# EAGLE board ADAT DeEnkoder v2 (EAGLE 5.03), part 1 of 2
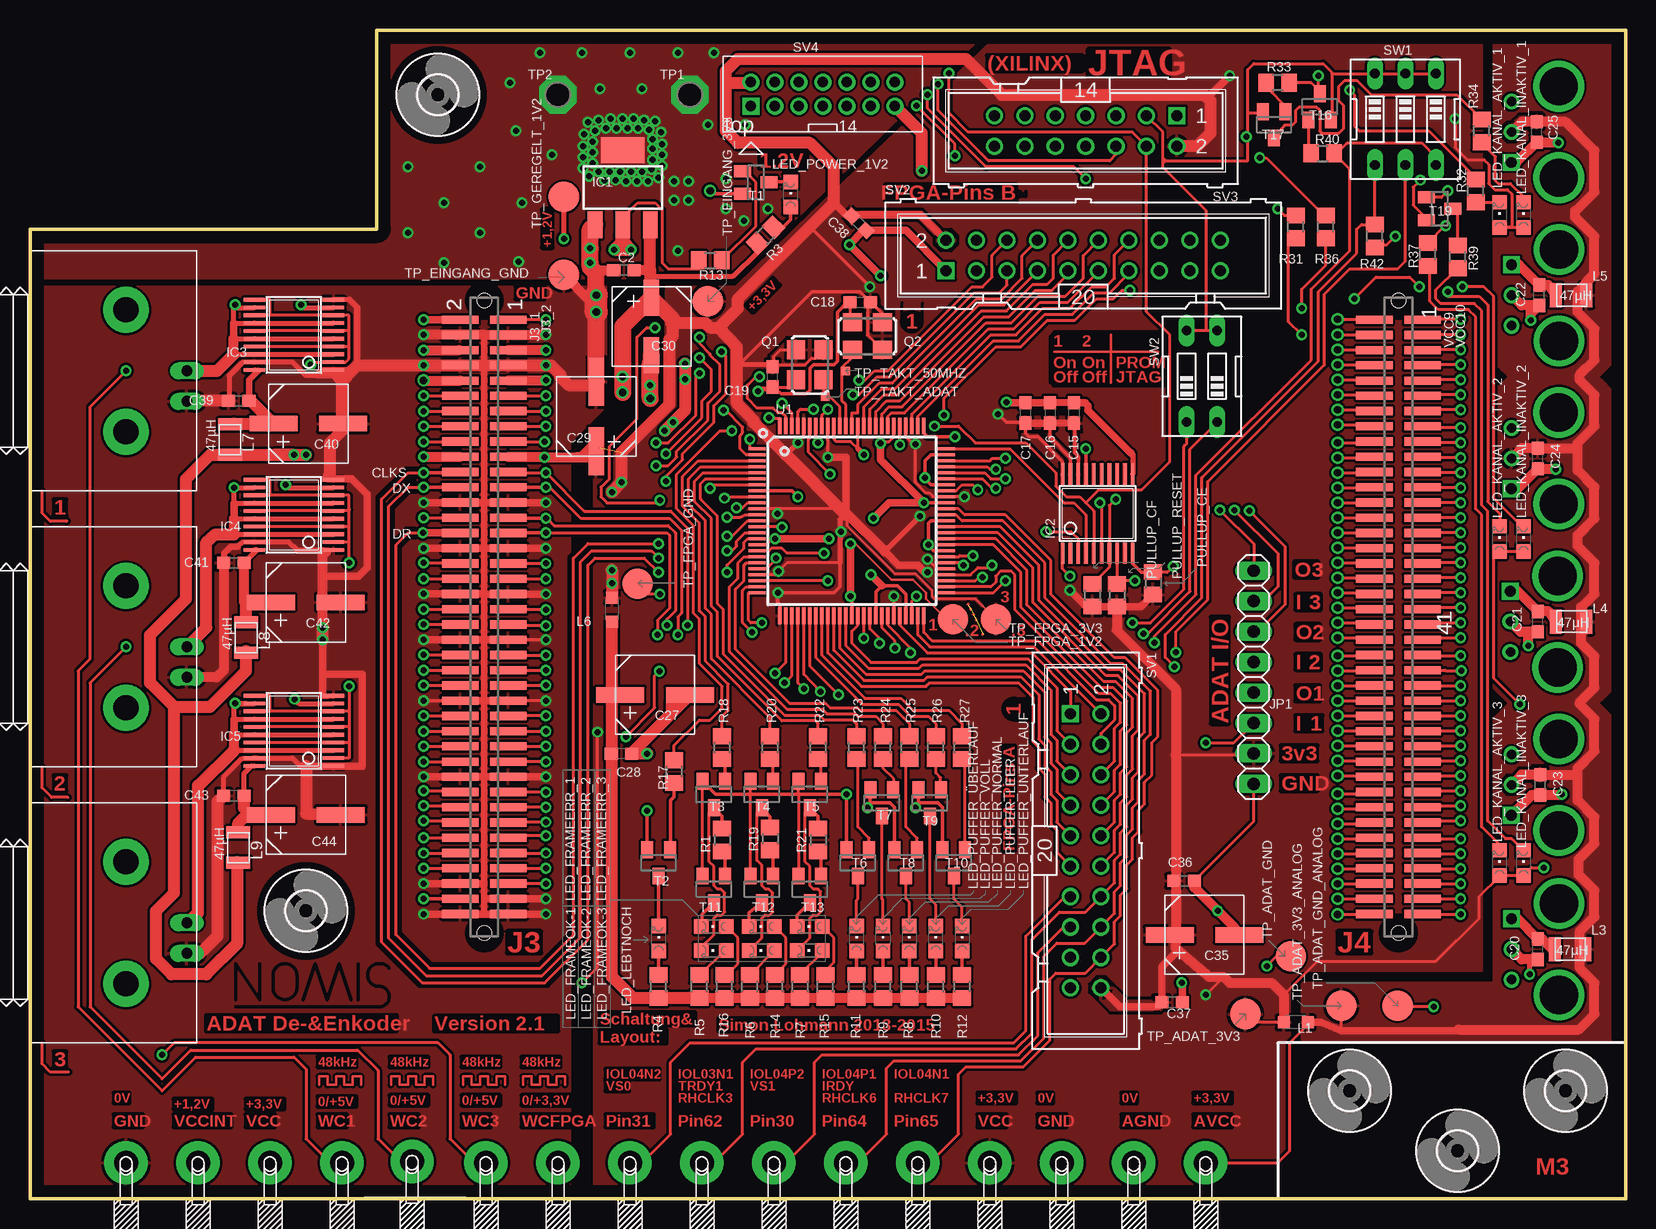
[diagram p2: board, top side]
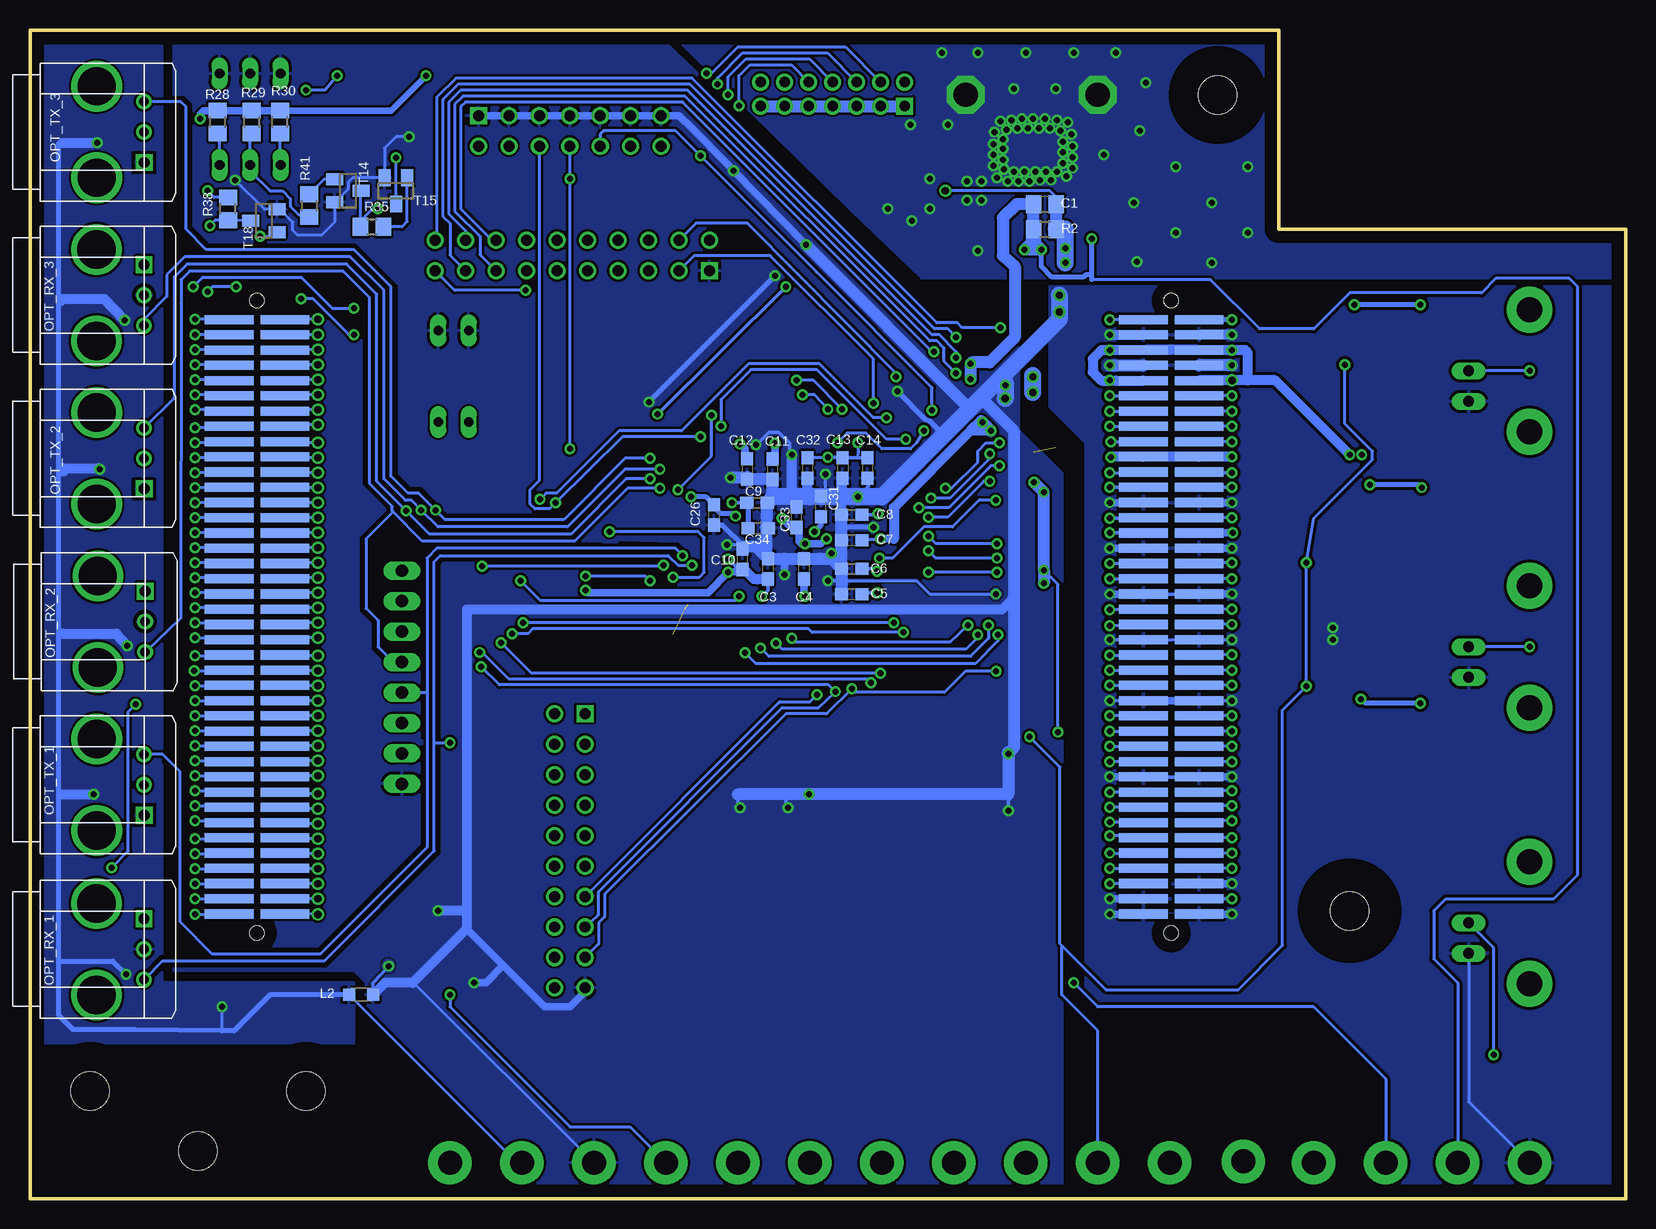
[diagram p3: board, bottom side, seen from below]

Size 133 x 97.4 mm. Coordinates in mm from the lower left corner, seen from the top.
Outline: 0,0 0,80.8 28.9,80.8 28.9,97.4 133,97.4 133,0 0,0
Copper layers (1*16): Top 0.035mm / dielectric 1.5mm / Bottom 0.035mm
Design rules "default *": minimum track width 0.2mm, minimum drill 0.4mm, track to track 0.2mm, track to pad 8mil, pad to pad 8mil, via to via 8mil, smd to smd 8mil, copper to edge 40mil, drill to drill 8mil, minimum pad ring 10mil, minimum via ring 8mil, stop-mask expansion 4mil, vias tented up to drill 0mil, thermal gap 10mil
tKeepout: area 17.2,81.8 to 27.9,95.6
tRestrict: area 81.1,39.9 to 82.9,41.7; area 72.6,72.2 to 74.4,74; 192 lines
bRestrict: area 122.5,47.2 to 124.3,49; area 122.7,74.5 to 124.3,76.1; 82 lines

## Footprints (pad centres in the part's own frame; a part is rotated, then mirrored left to right if it is on the bottom)
C0805 = smd 1.3 x 1.5: 1 -0.95,0; 2 0.95,0
C0603 = smd 1.1 x 1: 1 -0.85,0; 2 0.85,0
6.3²_LONGPADS = smd 1.3 x 4: + 0,2.9; - 0,-2.9
6.3² = smd 1.3 x 3: + 0,2.4; - 0,-2.4
SOT223 = smd 1.219 x 2.235: 1 -2.311,-3.099; 2 0,-3.099; 3 2.311,-3.099 | smd 3.6 x 2.2: 4 0,3.099
TSSOP20_LONGPAD = smd 0.305 x 1.778: 1 -2.925,-3.299; 2 -2.275,-3.299; 3 -1.625,-3.299; 4 -0.975,-3.299; 5 -0.325,-3.299; 6 0.325,-3.299; 7 0.975,-3.299; 8 1.625,-3.299; 9 2.275,-3.299; 10 2.925,-3.299; 11 2.925,3.299; 12 2.275,3.299; 13 1.625,3.299; 14 0.975,3.299; 15 0.325,3.299; 16 -0.325,3.299; 17 -0.975,3.299; 18 -1.625,3.299; 19 -2.275,3.299; 20 -2.925,3.299
J3_2X40SMD_TOP = smd 0.686 x 3.048: 1 -24.765,2.002; 2 -24.765,-2.002; 3 -23.495,2.002; 4 -23.495,-2.002; 5 -22.225,2.002; 6 -22.225,-2.002; 7 -20.955,2.002; 8 -20.955,-2.002; 9 -19.685,2.002; 10 -19.685,-2.002; 11 -18.415,2.002; 12 -18.415,-2.002; 13 -17.145,2.002; 14 -17.145,-2.002; 15 -15.875,2.002; 16 -15.875,-2.002; 17 -14.605,2.002; 18 -14.605,-2.002; 19 -13.335,2.002; 20 -13.335,-2.002; 21 -12.065,2.002; 22 -12.065,-2.002; 23 -10.795,2.002; 24 -10.795,-2.002; 25 -9.525,2.002; 26 -9.525,-2.002; 27 -8.255,2.002; 28 -8.255,-2.002; 29 -6.985,2.002; 30 -6.985,-2.002; 31 -5.715,2.002; 32 -5.715,-2.002; 33 -4.445,2.002; 34 -4.445,-2.002; 35 -3.175,2.002; 36 -3.175,-2.002; 37 -1.905,2.002; 38 -1.905,-2.002; 39 -0.635,2.002; 40 -0.635,-2.002; 41 0.635,2.002; 42 0.635,-2.002; 43 1.905,2.002; 44 1.905,-2.002; 45 3.175,2.002; 46 3.175,-2.002; 47 4.445,2.002; 48 4.445,-2.002; 49 5.715,2.002; 50 5.715,-2.002; 51 6.985,2.002; 52 6.985,-2.002; 53 8.255,2.002; 54 8.255,-2.002; 55 9.525,2.002; 56 9.525,-2.002; 57 10.795,2.002; 58 10.795,-2.002; 59 12.065,2.002; 60 12.065,-2.002; 61 13.335,2.002; 62 13.335,-2.002; 63 14.605,2.002; 64 14.605,-2.002; 65 15.875,2.002; 66 15.875,-2.002; 67 17.145,2.002; 68 17.145,-2.002; 69 18.415,2.002; 70 18.415,-2.002; 71 19.685,2.002; 72 19.685,-2.002; 73 20.955,2.002; 74 20.955,-2.002; 75 22.225,2.002; 76 22.225,-2.002; 77 23.495,2.002; 78 23.495,-2.002; 79 24.765,2.002; 80 24.765,-2.002 | hole 1.2: -26.352,0; 26.352,0
J3_2X40SMD_BOTTOM = smd 0.762 x 4.064 bottom: 1 -24.765,2.32; 2 -24.765,-2.32; 3 -23.495,2.32; 4 -23.495,-2.32; 5 -22.225,2.32; 6 -22.225,-2.32; 7 -20.955,2.32; 8 -20.955,-2.32; 9 -19.685,2.32; 10 -19.685,-2.32; 11 -18.415,2.32; 12 -18.415,-2.32; 13 -17.145,2.32; 14 -17.145,-2.32; 15 -15.875,2.32; 16 -15.875,-2.32; 17 -14.605,2.32; 18 -14.605,-2.32; 19 -13.335,2.32; 20 -13.335,-2.32; 21 -12.065,2.32; 22 -12.065,-2.32; 23 -10.795,2.32; 24 -10.795,-2.32; 25 -9.525,2.32; 26 -9.525,-2.32; 27 -8.255,2.32; 28 -8.255,-2.32; 29 -6.985,2.32; 30 -6.985,-2.32; 31 -5.715,2.32; 32 -5.715,-2.32; 33 -4.445,2.32; 34 -4.445,-2.32; 35 -3.175,2.32; 36 -3.175,-2.32; 37 -1.905,2.32; 38 -1.905,-2.32; 39 -0.635,2.32; 40 -0.635,-2.32; 41 0.635,2.32; 42 0.635,-2.32; 43 1.905,2.32; 44 1.905,-2.32; 45 3.175,2.32; 46 3.175,-2.32; 47 4.445,2.32; 48 4.445,-2.32; 49 5.715,2.32; 50 5.715,-2.32; 51 6.985,2.32; 52 6.985,-2.32; 53 8.255,2.32; 54 8.255,-2.32; 55 9.525,2.32; 56 9.525,-2.32; 57 10.795,2.32; 58 10.795,-2.32; 59 12.065,2.32; 60 12.065,-2.32; 61 13.335,2.32; 62 13.335,-2.32; 63 14.605,2.32; 64 14.605,-2.32; 65 15.875,2.32; 66 15.875,-2.32; 67 17.145,2.32; 68 17.145,-2.32; 69 18.415,2.32; 70 18.415,-2.32; 71 19.685,2.32; 72 19.685,-2.32; 73 20.955,2.32; 74 20.955,-2.32; 75 22.225,2.32; 76 22.225,-2.32; 77 23.495,2.32; 78 23.495,-2.32; 79 24.765,2.32; 80 24.765,-2.32 | hole 1.2: -26.352,0; 26.352,0
1X08 = drill 1.016 long: 1 -8.89,0; 2 -6.35,0; 3 -3.81,0; 4 -1.27,0; 5 1.27,0; 6 3.81,0; 7 6.35,0; 8 8.89,0
L2012C = smd 1 x 1: 1 -1,0; 2 1,0
1007_(2518METR.)_LONGPAD = smd 1 x 2: P$1 1.3,0; P$2 -1.24,0
CHIPLED_0805 = smd 1.2 x 1.2: A 0,-1.05; C 0,1.05
T = drill 0.9 square: 1 2.54,0 | drill 0.8 round: 2 0,0; 3 -2.54,0 | drill 3.2 pad 3.4 round: P$1 -3.81,3.95; P$2 3.81,3.95
PLT133 = drill 0.9 square: 1 -2.54,-3.81 | drill 0.8 round: 2 0,-3.81; 3 2.54,-3.81 | drill 3.2 pad 3.4 round: P$1 -3.81,0.14; P$2 3.81,0.14
R0805 = smd 1.3 x 1.5: 1 -0.95,0; 2 0.95,0
ASF = smd 1.6 x 1.5: 1 -1.25,-1.15; 2 1.25,-1.15; 3 1.25,1.15; 4 -1.25,1.15
ML20_ROUND_PAD = drill 0.914 square: 1 -11.43,-1.27 | drill 0.914 round: 2 -11.43,1.27; 3 -8.89,-1.27; 4 -8.89,1.27; 5 -6.35,-1.27; 6 -6.35,1.27; 7 -3.81,-1.27; 8 -3.81,1.27; 9 -1.27,-1.27; 10 -1.27,1.27; 11 1.27,-1.27; 12 1.27,1.27; 13 3.81,-1.27; 14 3.81,1.27; 15 6.35,-1.27; 16 6.35,1.27; 17 8.89,-1.27; 18 8.89,1.27; 19 11.43,-1.27; 20 11.43,1.27
ML14_ROUND_PAD = drill 0.914 square: 1 -7.62,-1.27 | drill 0.914 round: 2 -7.62,1.27; 3 -5.08,-1.27; 4 -5.08,1.27; 5 -2.54,-1.27; 6 -2.54,1.27; 7 0,-1.27; 8 0,1.27; 9 2.54,-1.27; 10 2.54,1.27; 11 5.08,-1.27; 12 5.08,1.27; 13 7.62,-1.27; 14 7.62,1.27
87831-1420 = drill 0.9 square: 1 -6,-1 | drill 0.9 round: 2 -6,1; 3 -4,-1; 4 -4,1; 5 -2,-1; 6 -2,1; 7 0,-1; 8 0,1; 9 2,-1; 10 2,1; 11 4,-1; 12 4,1; 13 6,-1; 14 6,1
EDG-03 = drill 0.813 long: 1 -2.54,-3.81; 2 0,-3.81; 3 2.54,-3.81; 4 2.54,3.81; 5 0,3.81; 6 -2.54,3.81
EDG-02 = drill 0.813 long: 1 -1.27,-3.81; 2 1.27,-3.81; 3 1.27,3.81; 4 -1.27,3.81
SOT23 = smd 1 x 1.4: 1 -0.95,-1.1; 2 0.95,-1.1; 3 0,1.1
P1-20 = drill 2.007 pad 3.15 octagon: TP 0,0
TESTPOINT-HOOK = drill 2 pad 3.607 round: P$1 0,0
B2,54 = smd 2.54 x 2.54: TP 0,0
TP07SQ = smd 0.7 x 0.7: TP 0,0
S-PQFP-G100 = smd 1.4 x 0.254: 1 -7.9,6; 2 -7.9,5.5; 3 -7.9,5; 4 -7.9,4.5; 5 -7.9,4; 6 -7.9,3.5; 7 -7.9,3; 8 -7.9,2.5; 9 -7.9,2; 10 -7.9,1.5; 11 -7.9,1; 12 -7.9,0.5; 13 -7.9,0; 14 -7.9,-0.5; 15 -7.9,-1; 16 -7.9,-1.5; 17 -7.9,-2; 18 -7.9,-2.5; 19 -7.9,-3; 20 -7.9,-3.5; 21 -7.9,-4; 22 -7.9,-4.5; 23 -7.9,-5; 24 -7.9,-5.5; 25 -7.9,-6; 51 7.9,-6; 52 7.9,-5.5; 53 7.9,-5; 54 7.9,-4.5; 55 7.9,-4; 56 7.9,-3.5; 57 7.9,-3; 58 7.9,-2.5; 59 7.9,-2; 60 7.9,-1.5; 61 7.9,-1; 62 7.9,-0.5; 63 7.9,0; 64 7.9,0.5; 65 7.9,1; 66 7.9,1.5; 67 7.9,2; 68 7.9,2.5; 69 7.9,3; 70 7.9,3.5; 71 7.9,4; 72 7.9,4.5; 73 7.9,5; 74 7.9,5.5; 75 7.9,6 | smd 0.254 x 1.4: 26 -6,-7.9; 27 -5.5,-7.9; 28 -5,-7.9; 29 -4.5,-7.9; 30 -4,-7.9; 31 -3.5,-7.9; 32 -3,-7.9; 33 -2.5,-7.9; 34 -2,-7.9; 35 -1.5,-7.9; 36 -1,-7.9; 37 -0.5,-7.9; 38 0,-7.9; 39 0.5,-7.9; 40 1,-7.9; 41 1.5,-7.9; 42 2,-7.9; 43 2.5,-7.9; 44 3,-7.9; 45 3.5,-7.9; 46 4,-7.9; 47 4.5,-7.9; 48 5,-7.9; 49 5.5,-7.9; 50 6,-7.9; 76 6,7.9; 77 5.5,7.9; 78 5,7.9; 79 4.5,7.9; 80 4,7.9; 81 3.5,7.9; 82 3,7.9; 83 2.5,7.9; 84 2,7.9; 85 1.5,7.9; 86 1,7.9; 87 0.5,7.9; 88 0,7.9; 89 -0.5,7.9; 90 -1,7.9; 91 -1.5,7.9; 92 -2,7.9; 93 -2.5,7.9; 94 -3,7.9; 95 -3.5,7.9; 96 -4,7.9; 97 -4.5,7.9; 98 -5,7.9; 99 -5.5,7.9; 100 -6,7.9
1-1634624-0 = drill 2.1 pad 3.81 round: MOUNT1 -5.08,0; MOUNT2 5.08,0 | drill 0.9 long: SHIELD -2.54,-5.08; SIGNAL 0,-5.08
3,2 = hole 3.2: 0,0
PINHEAD_2X40SMD = smd 0.686 x 3.048: 1 -24.765,2.002; 2 -24.765,-2.002; 3 -23.495,2.002; 4 -23.495,-2.002; 5 -22.225,2.002; 6 -22.225,-2.002; 7 -20.955,2.002; 8 -20.955,-2.002; 9 -19.685,2.002; 10 -19.685,-2.002; 11 -18.415,2.002; 12 -18.415,-2.002; 13 -17.145,2.002; 14 -17.145,-2.002; 15 -15.875,2.002; 16 -15.875,-2.002; 17 -14.605,2.002; 18 -14.605,-2.002; 19 -13.335,2.002; 20 -13.335,-2.002; 21 -12.065,2.002; 22 -12.065,-2.002; 23 -10.795,2.002; 24 -10.795,-2.002; 25 -9.525,2.002; 26 -9.525,-2.002; 27 -8.255,2.002; 28 -8.255,-2.002; 29 -6.985,2.002; 30 -6.985,-2.002; 31 -5.715,2.002; 32 -5.715,-2.002; 33 -4.445,2.002; 34 -4.445,-2.002; 35 -3.175,2.002; 36 -3.175,-2.002; 37 -1.905,2.002; 38 -1.905,-2.002; 39 -0.635,2.002; 40 -0.635,-2.002; 41 0.635,2.002; 42 0.635,-2.002; 43 1.905,2.002; 44 1.905,-2.002; 45 3.175,2.002; 46 3.175,-2.002; 47 4.445,2.002; 48 4.445,-2.002; 49 5.715,2.002; 50 5.715,-2.002; 51 6.985,2.002; 52 6.985,-2.002; 53 8.255,2.002; 54 8.255,-2.002; 55 9.525,2.002; 56 9.525,-2.002; 57 10.795,2.002; 58 10.795,-2.002; 59 12.065,2.002; 60 12.065,-2.002; 61 13.335,2.002; 62 13.335,-2.002; 63 14.605,2.002; 64 14.605,-2.002; 65 15.875,2.002; 66 15.875,-2.002; 67 17.145,2.002; 68 17.145,-2.002; 69 18.415,2.002; 70 18.415,-2.002; 71 19.685,2.002; 72 19.685,-2.002; 73 20.955,2.002; 74 20.955,-2.002; 75 22.225,2.002; 76 22.225,-2.002; 77 23.495,2.002; 78 23.495,-2.002; 79 24.765,2.002; 80 24.765,-2.002 | hole 1.2: -26.352,0; 26.352,0
PINHEAD_2X40SMDBOTTOM = smd 0.762 x 4.064 bottom: 1 -24.765,2.32; 2 -24.765,-2.32; 3 -23.495,2.32; 4 -23.495,-2.32; 5 -22.225,2.32; 6 -22.225,-2.32; 7 -20.955,2.32; 8 -20.955,-2.32; 9 -19.685,2.32; 10 -19.685,-2.32; 11 -18.415,2.32; 12 -18.415,-2.32; 13 -17.145,2.32; 14 -17.145,-2.32; 15 -15.875,2.32; 16 -15.875,-2.32; 17 -14.605,2.32; 18 -14.605,-2.32; 19 -13.335,2.32; 20 -13.335,-2.32; 21 -12.065,2.32; 22 -12.065,-2.32; 23 -10.795,2.32; 24 -10.795,-2.32; 25 -9.525,2.32; 26 -9.525,-2.32; 27 -8.255,2.32; 28 -8.255,-2.32; 29 -6.985,2.32; 30 -6.985,-2.32; 31 -5.715,2.32; 32 -5.715,-2.32; 33 -4.445,2.32; 34 -4.445,-2.32; 35 -3.175,2.32; 36 -3.175,-2.32; 37 -1.905,2.32; 38 -1.905,-2.32; 39 -0.635,2.32; 40 -0.635,-2.32; 41 0.635,2.32; 42 0.635,-2.32; 43 1.905,2.32; 44 1.905,-2.32; 45 3.175,2.32; 46 3.175,-2.32; 47 4.445,2.32; 48 4.445,-2.32; 49 5.715,2.32; 50 5.715,-2.32; 51 6.985,2.32; 52 6.985,-2.32; 53 8.255,2.32; 54 8.255,-2.32; 55 9.525,2.32; 56 9.525,-2.32; 57 10.795,2.32; 58 10.795,-2.32; 59 12.065,2.32; 60 12.065,-2.32; 61 13.335,2.32; 62 13.335,-2.32; 63 14.605,2.32; 64 14.605,-2.32; 65 15.875,2.32; 66 15.875,-2.32; 67 17.145,2.32; 68 17.145,-2.32; 69 18.415,2.32; 70 18.415,-2.32; 71 19.685,2.32; 72 19.685,-2.32; 73 20.955,2.32; 74 20.955,-2.32; 75 22.225,2.32; 76 22.225,-2.32; 77 23.495,2.32; 78 23.495,-2.32; 79 24.765,2.32; 80 24.765,-2.32 | hole 1.2: -26.352,0; 26.352,0

## Placement (x,y rotation side)
C1  10µF  [C0805]  48.4,82.9 0 bottom
C2  100nF  [C0603]  49.51,77.38 180 top
C3  100nF  [C0603]  71.5,52.5 270 bottom
C4  100nF  [C0603]  68.5,52.5 270 bottom
C5  100nF  [C0603]  64.5,50.4 0 bottom
C6  100nF  [C0603]  64.5,52.5 0 bottom
C7  100nF  [C0603]  64.5,54.9 0 bottom
C8  100nF  [C0603]  64.5,57 0 bottom
C9  100nF  [C0603]  72.4,58 0 bottom
C10  100nF  [C0603]  73.6,53.3 90 bottom
C11  100nF  [C0603]  71.1,60.8 270 bottom
C12  100nF  [C0603]  73.21,60.81 270 bottom
C13  100nF  [C0603]  65.26,60.9 270 bottom
C14  100nF  [C0603]  63.2,60.9 270 bottom
C15  100nF  [C0603]  87.04,65.5 90 top
C16  100nF  [C0603]  85.01,65.5 270 top
C17  100nF  [C0603]  82.96,65.5 270 top
C18  10nF  [C0603]  69.2,74.7 0 top
C19  10nF  [C0603]  61.9,68.5 90 top
C20  100nF  [C0603]  125.7,20.8 90 top
C21  100nF  [C0603]  125.7,48.1 90 top
C22  100nF  [C0603]  125.8,75.3 90 top
C23  100nF  [C0603]  125.9,34.5 90 top
C24  100nF  [C0603]  125.7,61.7 90 top
C25  100nF  [C0603]  125.6,88.9 90 top
C26  100nF  [C0603]  76,57 270 bottom
C27  330µF  [6.3²_LONGPADS]  52.1,42 90 top
C28  100nF  [C0603]  49.3,37.1 180 top
C29  330µF  [6.3²_LONGPADS]  47.2,65.2 180 top
C30  100µF  [6.3²]  51.8,72.7 0 top
C31  10nF  [C0603]  67.05,57.7 90 bottom
C32  10nF  [C0603]  68.2,60.9 270 bottom
C33  10nF  [C0603]  69.1,56.8 90 bottom
C34  10nF  [C0603]  72.3,55.9 0 bottom
C35  100µF  [6.3²_LONGPADS]  97.9,22 90 top
C36  100nF  [C0603]  96.2,26.5 0 top
C37  100nF  [C0603]  95.2,16.4 0 top
C38  100nF  [C0603]  69.1,81.3 315 top
C39  100nF  [C0603]  17.4,66.5 0 top
C40  100µF  [6.3²_LONGPADS]  23.2,64.6 90 top
C41  100nF  [C0603]  17,53 0 top
C42  100µF  [6.3²_LONGPADS]  23,49.7 90 top
C43  100nF  [C0603]  17,33.6 0 top
C44  100µF  [6.3²_LONGPADS]  23,32 90 top
IC1  [SOT223]  49.41,84.28 0 top
IC2  XCF02S-VO20/VOG20_LONGPAD  [TSSOP20_LONGPAD]  89,57.1 0 top
IC3  74ACT244MTC/TSSOP_LONGPAD  [TSSOP20_LONGPAD]  22,72 90 top
IC4  74ACT244MTC/TSSOP_LONGPAD  [TSSOP20_LONGPAD]  22,57 90 top
IC5  74ACT244MTC/TSSOP_LONGPAD  [TSSOP20_LONGPAD]  22,39 90 top
J3_1  J3_2X40SMD127_TOP  [J3_2X40SMD_TOP]  37.87,48.5 270 top
J3_2  J3_2X40SMD127_BOTTOM  [J3_2X40SMD_BOTTOM]  37.87,48.5 270 top
JP1  ADAT I/O  [1X08]  102,43.46 270 top
L1  Ferrit R_dc<=0.1 Ohm  [L2012C]  105.5,14.7 180 top
L2  Ferrit R_dc<=0.1 Ohm  [L2012C]  105.4,17 180 bottom
L3  47µH  [1007_(2518METR.)_LONGPAD]  128.4,20.8 180 top
L4  47µH  [1007_(2518METR.)_LONGPAD]  128.5,48.1 180 top
L5  47µH  [1007_(2518METR.)_LONGPAD]  128.5,75.3 180 top
L6  Ferrit R_dc<=0.1 Ohm  [L2012C]  48.5,49.1 90 top
L7  47µH  [1007_(2518METR.)_LONGPAD]  16.67,63.24 90 top
L8  47µH  [1007_(2518METR.)_LONGPAD]  18.02,46.74 90 top
L9  47µH  [1007_(2518METR.)_LONGPAD]  17.37,29.24 90 top
LED_FRAMEERR_1  Rot  [CHIPLED_0805]  57,22.7 90 top
LED_FRAMEERR_2  Rot  [CHIPLED_0805]  61,22.7 90 top
LED_FRAMEERR_3  Rot  [CHIPLED_0805]  65,22.7 90 top
LED_FRAMEOK-1  Grün  [CHIPLED_0805]  57,20.7 90 top
LED_FRAMEOK-2  Grün  [CHIPLED_0805]  61,20.7 90 top
LED_FRAMEOK-3  Grün  [CHIPLED_0805]  65,20.7 90 top
LED_KANAL_AKTIV_1  Grün  [CHIPLED_0805]  122.5,82 0 top
LED_KANAL_AKTIV_2  Grün  [CHIPLED_0805]  122.5,55 0 top
LED_KANAL_AKTIV_3  Grün  [CHIPLED_0805]  122.5,28 0 top
LED_KANAL_INAKTIV_1  Rot  [CHIPLED_0805]  124.5,82 0 top
LED_KANAL_INAKTIV_2  Rot  [CHIPLED_0805]  124.5,55 0 top
LED_KANAL_INAKTIV_3  Rot  [CHIPLED_0805]  124.5,28 0 top
LED_LEBTNOCH  Grün  [CHIPLED_0805]  52.4,21.7 0 top
LED_POWER_1V2  Grün  [CHIPLED_0805]  63.4,83.7 0 top
LED_PUFFER_LEER  Gelb  [CHIPLED_0805]  75.5,21.7 0 top
LED_PUFFER_NORMAL  Grün  [CHIPLED_0805]  73.3,21.7 0 top
LED_PUFFER_UNTERLAUF  Rot  [CHIPLED_0805]  77.7,21.7 0 top
LED_PUFFER_VOLL  Gelb  [CHIPLED_0805]  71.1,21.7 0 top
LED_PUFFER_ÜBERLAUF  Rot  [CHIPLED_0805]  68.9,21.7 0 top
OPT_RX_1  PLR135/T  [T]  123.5,20.8 90 bottom
OPT_RX_2  PLR135/T  [T]  123.4,48.1 90 bottom
OPT_RX_3  PLR135/T  [T]  123.5,75.3 90 bottom
OPT_TX_1  PLT133  [PLT133]  127.3,34.5 90 bottom
OPT_TX_2  PLT133  [PLT133]  127.3,61.7 90 bottom
OPT_TX_3  PLT133  [PLT133]  127.3,88.9 90 bottom
PULLUP_CE  330R  [R0805]  93.62,51.3 270 top
PULLUP_CF  4k7  [R0805]  88.58,50.3 90 top
PULLUP_RESET  4k7  [R0805]  90.6,50.3 270 top
Q1  ASFL1 12.288MHz  [ASF]  65,69.5 270 top
Q2  ASFL1 50MHz  [ASF]  69.8,71.9 180 top
R1  13K  [R0805]  57.7,29.9 270 top
R2  120R  [R0805]  48.4,80.8 0 bottom
R3  55R  [R0805]  61.3,80.3 45 top
R4  55R  [R0805]  52.4,17.7 90 top
R5  55R  [R0805]  55.8,17.7 90 top
R6  55R  [R0805]  60,17.7 90 top
R7  55R  [R0805]  64.2,17.7 90 top
R8  55R  [R0805]  73.3,17.7 90 top
R9  65R  [R0805]  71.1,17.7 90 top
R10  65R  [R0805]  75.5,17.7 90 top
R11  75R  [R0805]  68.9,17.7 90 top
R12  75R  [R0805]  77.7,17.7 90 top
R13  2k5  [R0805]  56.7,78.2 0 top
R14  75R  [R0805]  62.1,17.7 90 top
R15  75R  [R0805]  66.3,17.7 90 top
R16  75R  [R0805]  57.9,17.7 90 top
R17  13K  [R0805]  53.7,35.6 90 top
R18  13K  [R0805]  57.7,37.6 90 top
R19  13K  [R0805]  61.7,30 270 top
R20  13K  [R0805]  61.7,37.6 90 top
R21  13K  [R0805]  65.7,29.9 270 top
R22  13K  [R0805]  65.7,37.6 90 top
R23  13K  [R0805]  68.9,37.6 90 top
R24  13K  [R0805]  71.1,37.6 90 top
R25  13K  [R0805]  73.3,37.6 90 top
R26  13K  [R0805]  75.5,37.6 90 top
R27  13K  [R0805]  77.7,37.6 90 top
R28  1K  [R0805]  117.36,89.74 90 bottom
R29  1K  [R0805]  114.51,89.74 90 bottom
R30  1K  [R0805]  112.16,89.74 90 bottom
R31  55R  [R0805]  105.5,81 90 top
R32  55R  [R0805]  120.5,84 90 top
R33  13K  [R0805]  104,93 180 top
R34  75R  [R0805]  121,89 90 top
R35  13K  [R0805]  104.5,81 0 bottom
R36  75R  [R0805]  108,81 90 top
R37  55R  [R0805]  116.5,78.7 90 top
R38  13K  [R0805]  116.5,82.5 90 bottom
R39  75R  [R0805]  119,78.5 90 top
R40  12K  [R0805]  107.75,87.11 0 top
R41  12K  [R0805]  109.74,82.76 270 bottom
R42  12K  [R0805]  112.09,80.24 90 top
SV1  [ML20_ROUND_PAD]  88,29 270 top
SV2  [ML20_ROUND_PAD]  87.8,78.6 0 top
SV3  [ML14_ROUND_PAD]  88,89 180 top
SV4  [87831-1420]  66.09,92.06 0 top
SW1  [EDG-03]  114.65,89.96 180 top
SW2  [EDG-02]  97.69,68.54 0 top
T1  BC847A  [SOT23]  60.5,84.7 270 top
T2  BC847A  [SOT23]  52.4,28 180 top
T3  BC847A  [SOT23]  57,33.7 180 top
T4  BC847A  [SOT23]  61,33.7 180 top
T5  BC847A  [SOT23]  65,33.7 180 top
T6  BC847A  [SOT23]  69,28 180 top
T7  BC847A  [SOT23]  71,33 180 top
T8  BC847A  [SOT23]  73,28 180 top
T9  BC847A  [SOT23]  75,33 180 top
T10  BC847A  [SOT23]  77,28 180 top
T11  BC847A  [SOT23]  57,25.8 180 top
T12  BC847A  [SOT23]  61,25.8 180 top
T13  BC847A  [SOT23]  65,25.8 180 top
T14  BC847A  [SOT23]  106.5,84 270 bottom
T15  BC847A  [SOT23]  102.5,84 180 bottom
T16  BC847A  [SOT23]  107.5,91 0 top
T17  BC847A  [SOT23]  103.7,89.5 180 top
T18  BC847A  [SOT23]  113.5,81.5 90 bottom
T19  BC847A  [SOT23]  117.5,82.5 270 top
TP1  [P1-20]  55,92 0 top
TP2  [P1-20]  44,92 0 top
TP_1  TESTPOINTHOOK  [TESTPOINT-HOOK]  80,3 0 top
TP_2  TESTPOINTHOOK  [TESTPOINT-HOOK]  98,3 0 top
TP_3  TESTPOINTHOOK  [TESTPOINT-HOOK]  92,3 0 top
TP_3V3  TESTPOINTHOOK  [TESTPOINT-HOOK]  20,3 0 top
TP_4  TESTPOINTHOOK  [TESTPOINT-HOOK]  86,3 0 top
TP_ADAT_3V3  [B2,54]  101.3,15.4 0 top
TP_ADAT_3V3_ANALOG  [B2,54]  109.3,16.1 0 top
TP_ADAT_GND  [B2,54]  105.1,20.2 0 top
TP_ADAT_GND_ANALOG  [B2,54]  114,16.1 0 top
TP_EINGANG_3V3  [B2,54]  56.5,74.8 0 top
TP_EINGANG_GND  [B2,54]  44.5,77 0 top
TP_FPGA_1V2  [B2,54]  76.92,48.29 0 top
TP_FPGA_3V3  [B2,54]  80.53,48.29 0 top
TP_FPGA_GND  [B2,54]  50.66,51.26 0 top
TP_GEREGELT_1V2  [B2,54]  44.5,83.5 0 top
TP_GND  TESTPOINTHOOK  [TESTPOINT-HOOK]  8,3 0 top
TP_GND1  TESTPOINTHOOK  [TESTPOINT-HOOK]  26,3 0 top
TP_GND4  TESTPOINTHOOK  [TESTPOINT-HOOK]  44,3 0 top
TP_GND5  TESTPOINTHOOK  [TESTPOINT-HOOK]  31.85,3.11 0 top
TP_GND6  TESTPOINTHOOK  [TESTPOINT-HOOK]  38,3 0 top
TP_IO_L03N_1/TRDY1/RHCLK3  TESTPOINTHOOK  [TESTPOINT-HOOK]  56,3 0 top
TP_IO_L04N_1/RHCLK7  TESTPOINTHOOK  [TESTPOINT-HOOK]  74,3 0 top
TP_IO_L04N_2/VS0  TESTPOINTHOOK  [TESTPOINT-HOOK]  50,3 0 top
TP_IO_L04P_1/IRDY/RHCLK6  TESTPOINTHOOK  [TESTPOINT-HOOK]  68,3 0 top
TP_IO_L04P_2/VS1  TESTPOINTHOOK  [TESTPOINT-HOOK]  62,3 0 top
TP_TAKT_50MHZ  [TP07SQ]  68,69 0 top
TP_TAKT_ADAT  [TP07SQ]  66.3,66.85 0 top
TP_VCCINT  TESTPOINTHOOK  [TESTPOINT-HOOK]  14,3 0 top
U1  XC3S200A  [S-PQFP-G100]  68.5,56.5 0 top
U$1  B6252H7NPP3G75T_  [1-1634624-0]  8,69 90 top
U$2  B6252H7NPP3G75T_  [1-1634624-0]  8,46 90 top
U$3  B6252H7NPP3G75T_  [1-1634624-0]  8,23 90 top
U$4  [3,2]  128,9 0 top
U$5  [3,2]  119,4 0 top
U$6  [3,2]  110,9 0 top
U$7  [3,2]  23,24 0 top
U$8  [3,2]  34,92 0 top
VCC9  PINHEAD_2X40SMD127  [PINHEAD_2X40SMD]  114.07,48.5 270 top
VCC10  PINHEAD_2X40SMD127BOTTOM  [PINHEAD_2X40SMDBOTTOM]  114.07,48.5 270 top

## Tracks (layer width: path | path; a pad name or v marks a point on that pad's centre or on a via)
3.3V_LED
  Top 0.254: 48.5,41.5 C27.+ | 48.6,42.2 48.5,42.4 48.6,37.6
  Top 0.305: R12.1 77.45,17
  Top 0.406: 48.5,42.2 C27.+ | 48.5,38 C28.2
  Top 0.813: R5.1 R16.1 R6.1 R14.1 R7.1 R15.1 R11.1 R9.1 R8.1 R10.1 R12.1
  Top 1.016: 48.5,42.2 L6.1 | 48.5,42.2 48.5,41.5 48.5,38 48.5,18.5 50.25,16.75 R4.1 | 48.5,42.2 48.5,42.4 | R4.1 52.4,16.8 | R4.1 R5.1 | R4.1 52.4,16.7
+3V3  (via drill 0.5, 0.6)  (1 unrouted)
  Top 0.203: 68.1,56.9 68.1,56.1 72.1,52.1 73.8,52.1 75.2,50.7 75.2,50.2 75.4,50 78.82,50 TP_FPGA_3V3.TP
  Top 0.254: U1.79 73,63.5 73.6,62.9 v73.8,62.9 73.8,59.7 74.7,58.8 75,58.8 75.3,58.5 v77.9,58.5 | U1.22 62.1,52 63.1,53 67.5,53 | 61.9,57.5 U1.11 | 61.9,57.5 v62.3,57.1 | v66.5,61.8 U1.92 | U1.96 64.5,63.6 64,63.1 v64,63 | 68,57.5 61.9,57.5 | Q2.4 69.8,72 69.8,74.4 | C18.2 69.9,74.7 69.8,74.6 69.8,74.4 | 70.1,74.7 69.8,74.4 | Q1.1 62.55,70.75 62,70.2 62,69.5 | Q1.4 66.2,70.5 65.45,70.05 65.15,70.05 64.6,69.5 62.15,69.5 | C19.2 62.15,69.5 | 62.15,69.5 62,69.5 | C19.2 62,69 | C19.2 62,69.5 | U1.55 75.6,52.5 v74.8,53.3 | C35.+ 95.7,22 95.55,22.55 | JP1.7 101.89,37 95.5,37 | TP_ADAT_3V3.TP 102,14.7 L1.2 | LED_KANAL_INAKTIV_1.A LED_KANAL_AKTIV_1.A 123.5,80.95 123.5,83.75 123.15,84.1 122.1,84.1 121.6,84.6 121.6,86.2 121.2,86.6 119.8,86.6 118.8,87.6 v118.8,90 | LED_KANAL_INAKTIV_2.A LED_KANAL_AKTIV_2.A 122.5,53.9 122,53.4 122,43.4 v124.2,41.2 | 104.5,17 107.3,19.8 117.2,19.8 120.8,23.4 120.8,25.2 122.5,26.9 LED_KANAL_AKTIV_3.A LED_KANAL_INAKTIV_3.A 125.15,27.6 v126.2,27.6 | v46,18 47.3,19.3 v47.3,38.9 | 99.5,18.5 v98,17 | J3_1.20 36,61.97 36,62 35.83,61.83 J3_2.20
  Top 0.305: v72,50.2 U1.45 | 63,62 68,57.5 | 67.5,53 67.5,51 67,50.5 62.3,50.5 62.3,49.75 62.5,49.55 U1.26 | Q2.1 71.05,73.75 70.1,74.7 69.2,75.6 65.2,75.6 59.15,69.55 60.5,69.5 | 85.1,64.4 85.01,64.51 C16.2 85.01,63.49 86.72,61.77 IC2.19 86.72,60.23 | IC1.3 51.72,81.28 | 87,65 87,64.69 C15.1 | C17.2 82.96,64.74 | C17.2 82.9,64.7 81.4,64.7 v80.7,65.4 | 64.5,80 65,81 v70,76 | IC2.18 87.38,61.88 87.1,62.15 87.1,64.59 C15.1 | 87,64.66 C15.1 | IC2.20 86.08,61.42 84,63.5 83.25,63.5 82.96,63.79 C17.2
  Top 0.406: 67.5,53 67.5,55.5 v67.6,55.6 67.5,55.6 67.5,56.6 67.9,57 68,57 | 63,62 v64,63 | 71.25,53.95 v74.2,56.9 | C19.2 62.1,69.45 62.1,69.6 62.05,69.55 59.15,69.55 58.9,69.55 | R3.1 60.65,78.9 58.6,76.9 51.8,76.9 51.7,77
  Top 0.61: v66.5,61.8 68,61.8 68,57.5 68,57 68.1,56.9 | v74.8,52.2 74.7,52.1 74,52.8 72.4,52.8 71.25,53.95 | C17.2 C16.2 87,64.66 | 95.5,22.5 95.5,20.9 95.5,20.5 94.35,19.35 C37.1 94.35,16.35 94,16 90.84,16 SV1.20 | SV2.2 74.24,82 68.6,82 C38.1 68.1,81.9 67,83 | 98.15,91.75 v100,93.6 | 45.8,61.8 47.5,63.5 47.5,62.6 C29.+ | v86.7,50.7 88.05,49.35 PULLUP_CF.1 PULLUP_RESET.2 92.62,49.35 PULLUP_CE.2
  Top 0.813: 95.5,26.5 95.5,37 95.5,42.5 90.6,47.4 PULLUP_RESET.2 | 95.5,26.5 95.5,22.5 95.55,22.55 95.55,21.55 95.5,20.9 98.3,18.5 99.5,18.5 100,18 103.5,18 104.5,17 L1.2 | 51.7,81.16 IC1.3 | 51.7,77.38 C2.1 | 95.5,26.5 C36.1 | 71.25,53.95 68.02,57.18 67.83,57.18 67.83,57.17 | 32.75,61.83 v32.8,61.83 J3_2.20 35.83,61.83 | J3_1.19 39.9,61.8 v42.9,61.8 45.6,61.8 | 45.6,61.8 46.7,61.8 C29.+ | 45.6,61.8 45.8,61.8
  Top 1.016: 57.4,72.6 56.7,72.6 56.3,73 53.6,73 53.6,71.9 53.3,71.6 53.3,66.2 49.3,62.2 v49.3,59.7 v48.5,58.9 | 57.4,72.6 58.9,71 58.9,69.55 58.9,66.3 60.3,64.9 60.3,64.7 63,62 67.83,57.17 68,57 | 51.7,77.38 51.7,81.16 | 51.7,77.38 51.7,77 | C30.+ 51.7,77.38 | 58,93 58,89 59,88 65,88 67,86 67,83 65,81 59,75 59,74.2 57.4,72.6 | 58,93 58,94 59,95 78,95 81,92 97.9,92 98.15,91.75 98.4,91.5 98.4,88.8 97.32,87.72 SV3.2 | v48.5,52.4 L6.2 | SV4.2 60.03,93 58,93 | C38.1
  Top 1.27: C30.+ 53.6,73.3 53.6,73
  Top 1.422: C30.+ 49.4,72.7 v49.4,67.2
  Bottom 0.254: v64,63 64,62 | 73.55,52.25 C10.1 | 66.6,61.75 C32.1 | 66.6,61.75 66.6,61.8 | v74.8,52.2 74.4,52.4 74,52.8 | 66.6,61.75 66.55,61.8 v66.5,61.8 | v124.2,41.2 124.8,40.6 124.8,29 v126.2,27.6 | TP_3V3.P$1 20,10 26,16 44,16 v46,18 | v47.3,38.9 47.3,51.2 v48.5,52.4 | TP_1.P$1 83,6 88,6 98,16 v98,17
  Bottom 0.305: v62.4,52.3 62.6,52.5 C6.2 | v62.3,57.1 62.4,57 C8.2 | 71.6,51.7 C3.2 71.5,50.7 v72,50.2 | v74.8,53.3 74,52.5 73.5,52.5 | v66.5,61.8 65.3,61.8 C13.1 C14.1 | v62.35,50.5 63.55,50.5 arc-90 C5.2 | v70,76 v80.7,65.4
  Bottom 0.406: 73.35,52.35 73.4,52.4 73.5,52.5 | v74.2,56.9 74.4,57.1 75.4,57.1 76,57.7 C26.1 76.65,58.5 v77.9,58.5 | C31.1 67.05,56.15 v67.6,55.6 | v66.5,61.8 66.55,61.75 | 32.83,61.83 v32.8,61.83 J3_2.20
  Bottom 0.55: R30.2 102.91,90.69 v100,93.6
  Bottom 0.61: v73.8,62.9 73.4,62.5 73.4,62 C12.1 | C3.2 72.35,51.5 73.4,52.4 73.55,52.25 v74.8,52.2 76.5,50.5 86.5,50.5 v86.7,50.7 | R30.2 R29.2 R28.2 118.51,90.69 118.8,90.4 v118.8,90
  Bottom 0.813: C3.2 72.65,51.65 73.35,52.35 | 32.83,61.83 J3_2.20 J3_2.19 42.87,61.83 v42.9,61.8
  Bottom 1.016: v49.3,59.7 v48.5,58.9 v48.5,52.4 v48.5,51.3 | 49.4,68.6 49.5,68.5 v49.4,68.5
  Bottom 1.422: v49.4,67.2 v49.4,68.5 49.4,68.6
  pour Top: 80.2,96.5 65.2,82.2 58.8,76 53,76 52.9,66.4 47,60.5 47,1 105,1 105,18 106,19 121,19 121,96.8
+5V  (via drill 0.5, 0.6)
  Top 0.254: 39.75,70.75 J3_1.5 J3_2.5 | 35.79,70.72 J3_1.6
  Top 0.305: 39.89,70.72 arc-90 J3_1.5
  Top 0.406: v43,68.2 43,68.18 | L7.P$2 17.5,62
  Top 0.813: v32.8,70.72 35.79,70.72 | v43,70.72 J3_2.5 39.89,70.72 | J3_1.10 32.82,68.18 v32.8,68.2 | J3_1.9 42.98,68.18 v43,68.2
  Top 1.016: 12,41 15,41 18,44 18,45.67 L8.P$2 | 12,41 12,25.5 10.5,24 10.5,20 11.8,18.7 14.7,18.7 17.25,21.25 17.25,28.07 L9.P$2 | v22,62 17.5,62 15,62 13,60 13,50 10,47 10,43 12,41 | v22,62 v23,62 | v22,62 20.3,62
  Bottom 0.254: 35.65,70.75 J3_2.6 | 40,70.75 J3_2.5 | 35.45,70.72 35.5,70.6 | 37.95,70.75 37.9,70.7
  Bottom 0.305: 40,70.75 40,70.72
  Bottom 0.406: 35.45,70.72 35.65,70.75
  Bottom 0.61: v43,68.2 43.2,68.2 | 40,70.75 40.03,70.72 v43,70.72
  Bottom 0.813: 40,70.75 37.95,70.75 35.65,70.75 | 35.45,70.72 v32.8,70.72 31.72,70.72 31.5,70.5 31.5,68.2 | 40,70.72 v43,70.72 43.68,70.72 44.4,70 44.4,68.9 43.68,68.18 43.02,68.18 v43,68.2 42.48,68.18 J3_2.9 | J3_2.10 35.53,68.2 v32.8,68.2 31.5,68.2 | v23,62 29.2,68.2 31.5,68.2
+12V  (via drill 0.5)
  Top 0.254: v43,73.26 J3_1.1
  Bottom 0.254: J3_2.1 v43,73.26
-12V  (via drill 0.5)
  Top 0.61: 32.75,73.26 v32.8,73.26 J3_1.2
  Bottom 0.254: v32.8,73.26 J3_2.2 35.95,73.26
  Bottom 0.406: v32.8,73.26 J3_2.2
ACE3#  (via drill 0.5)
  Top 0.254: v43,30.25 40,30.25 J3_1.69
  Bottom 0.254: v43,30.25 40.25,30.25 J3_2.69
ADAT_IN_1  (via drill 0.5)
  Top 0.254: U1.56 77.6,53 v77.8,52.8 | JP1.6 100.35,38 v98,38
  Bottom 0.254: v77.8,52.8 79,52.8 79.8,53.6 98.8,53.6 99.3,53.1 99.3,38 | 99.3,38 99.3,29 108.5,19.8 121.96,19.8 OPT_RX_1.3 | 99.3,38 v98,38
ADAT_IN_2  (via drill 0.5)
  Top 0.254: U1.70 79.4,60 80.2,59.2 v80.5,59.2
  Bottom 0.254: v80.5,59.2 83.2,59.2 87.6,54.8 100.3,54.8 102.75,57.25 | 102.75,57.25 102.8,57.3 102.8,57.7 104.7,59.6 104.7,75.1 106.9,77.3 119.7,77.3 120.4,76.6 120.4,74.6 120.44,48.4 OPT_RX_2.3 | JP1.4 102.73,44.73 104,46 104,48.2 105,49.2 105,55 102.75,57.25
ADAT_IN_3  (via drill 0.5)
  Top 0.254: U1.72 79.8,61 80,60.8 v80.5,60.8 | JP1.2 102.81,49.81 104,51 104,53.8 v100.4,57.4
  Bottom 0.254: v80.5,60.8 83.4,60.8 88.2,56 99,56 v100.4,57.4 101.2,58.2 101.7,58.2 103.5,60 103.5,75.7 106.3,78.5 120.1,78.5 121.6,77 121.6,75.2 123.5,73.3 OPT_RX_3.3
ADAT_OUT_1  (via drill 0.5)
  Top 0.254: U1.57 77.4,53.5 77.5,53.6 v78.6,53.6
  Bottom 0.254: v78.6,53.6 79.2,54.2 99.1,54.2 99.9,53.4 99.9,42.1 | 99.9,42.1 99.9,29.3 108.8,20.4 117.8,20.4 120.5,23.1 120.5,35.6 121.94,37.04 OPT_TX_1.3 | JP1.5 99.89,42.19 99.9,42.1
ADAT_OUT_2  (via drill 0.5)
  Top 0.254: JP1.3 102.37,47.27 104.6,49.5 104.6,54.4 v101.65,57.35 | U1.71 79.6,60.5 80.1,60 v81.3,60
  Bottom 0.254: v81.3,60 83.3,60 87.9,55.4 99.7,55.4 v101.65,57.35 104.1,59.8 104.1,75.4 106.6,77.9 119.9,77.9 121,76.8 121,66.73 OPT_TX_2.3
ADAT_OUT_3  (via drill 0.5)
  Top 0.254: U1.73 80,61.5 80.2,61.7 v81.3,61.7 | JP1.1 102,54.6 v99.2,57.4
  Bottom 0.254: v81.3,61.7 83.4,61.7 88.5,56.6 98.4,56.6 v99.2,57.4 100.6,58.8 101.5,58.8 102.9,60.2 102.9,76 106,79.1 118.3,79.1 120,80.8 120,91 120.44,91.44 OPT_TX_3.3
AGND  (via drill 0.5)
  Top 0.254: TP_ADAT_GND_ANALOG.TP 114.1,16 v117,16
  Top 0.406: v125,18.7 125,19.55 C20.1
  Top 0.813: C20.1 124.35,19.95 OPT_RX_1.2 | OPT_TX_1.1 125.18,33.65 C23.1 127.65,33.65 v127.7,33.7 | OPT_RX_2.2 124.25,47.25 C21.1 125.25,47.25 124.9,46.9 v124.9,46.1 | OPT_TX_2.1 124.01,59.16 C24.1 125.75,60.8 v127.2,60.8 | OPT_RX_3.2 124.35,74.45 C22.1 125.2,73.85 125.1,73.95 | v125.1,73.2 125.1,73.95 | 125.1,73.95 125.1,74 | OPT_TX_3.1 123.91,86.36 C25.1 125.65,88 v127.4,88
  Bottom 0.254: 117,14 v117,16 | 130.6,33.6 130.5,33.7 | 130.5,33.7 130.7,33.7 | 130.5,33.7 130.4,33.7 | 130.6,47 130.3,47.1 | 130.5,60.9 130.2,60.6 | 130.6,75 130.4,74.8 | L2.2 92.4,3 TP_3.P$1
  Bottom 0.305: 130.6,88 130.3,88
  Bottom 0.406: 130.6,61 130.6,47 130.6,33.6 130.6,19.8 | 130.6,61 130.6,75 130.6,88 | 130.6,61 130.5,60.9 | L2.2 113,17 116,14 117,14 124.3,14.1 129.4,14.1 130.6,15.3 130.6,19.8 | 130.6,19.8 126.1,19.8 v125,18.7
  Bottom 0.813: 130.4,33.7 v127.7,33.7 | v124.9,46.1 125.8,47.1 130.3,47.1 | v127.2,60.8 127.3,60.9 130.3,60.9 130.2,60.6 | v125.1,73.2 126.8,75 130.4,75 130.4,74.8 | 130.3,88 v127.4,88
  pour Bottom: 122,96.8 132,96.8 132,13 106,13 106,18 122,18
AVCC
  Top 0.254: 109.3,14 TP_ADAT_3V3_ANALOG.TP | L1.1 106.5,14.5 105,13 105,4 104,3 TP_2.P$1
  Top 0.55: 129.55,76.15 L5.P$2
  Top 0.61: L1.1 107.6,14.7 109.3,14 119,14 119.1,14.1
  Top 0.813: 119.1,14.1 129.1,14.1 130.4,15.4 130.4,18 129.2,19.2 129.2,20.7 | 129.2,20.7 129.2,22.3 130.4,23.5 130.4,25.7 129.1,27 129.1,28.3 130.4,29.6 130.4,31.8 129,33.2 129,35.3 | 129,35.3 129,35.9 130.4,37.3 130.4,40 129.2,41.2 129.2,41.4 130.4,42.6 130.4,45.2 129.3,46.3 129.3,48.2 | 129.3,48.2 129.3,49.3 130.4,50.4 130.4,53 129,54.4 129,55.3 130.4,56.7 130.4,59.3 129,60.7 129,62.5 | 129,62.5 129,63 130.4,64.4 130.4,67 129.2,68.2 129.2,68.7 130.4,69.9 130.4,72.5 129,73.9 129,75.6 130.4,77.1 | 130.4,77.1 130.4,80.2 128.8,81.8 128.8,82.3 130.4,83.9 130.4,87.35 128,89.75 C25.2 124.34,89.75 OPT_TX_3.2 | 129.2,20.7 L3.P$2 | 129,35.3 125.95,35.3 C23.2 124.34,35.35 OPT_TX_1.2 | 129.3,48.2 L4.P$2 | 129,62.5 125.75,62.5 C24.2 124.34,62.55 OPT_TX_2.2 | 130.4,77.1 129.6,76.2 129.55,76.15
  pour Top: 122,96.8 132,96.8 132,13 106,13 106,18 122,18
CLK_50MHZ
  Top 0.254: U1.89 68,66.2 67.7,66.5 67.7,69 | 67.7,69 67.7,69.3 68.5,70.1 Q2.3 | 67.7,69 TP_TAKT_50MHZ.TP
CLK_ADAT_BIT
  Top 0.254: 66.15,68.15 66.2,68.1 66.2,67.3 67.5,66 U1.90 | TP_TAKT_ADAT.TP 66.15,66.95 66.15,68.15 | 66.15,68.15 Q1.3
CLKR0  (via drill 0.5)
  Top 0.254: v53.1,47.8 53.1,48.3 53.8,49 53.8,55.5 53.2,56.1 43.7,56.1 43.1,56.7 v43,56.7 | v72.1,45.9 72.1,46.5 71,47.6 U1.43
  Top 0.305: v43,56.7 39.92,56.7 arc-90 J3_1.27
  Bottom 0.254: v53.1,47.8 53.1,46.7 54.6,45.2 71.4,45.2 v72.1,45.9
  Bottom 0.305: J3_2.27 40.24,56.7 v43,56.7
CLKR2  (via drill 0.5)
  Top 0.254: J3_1.39 39.87,49.1 v43,49.1
  Bottom 0.254: v43,49.1 40.22,49.1 arc-90 J3_2.39
CLKS0  (via drill 0.5)
  Top 0.254: U1.16 59.8,55 59.5,54.7 59.5,54.2 58.1,52.8 v58.1,52.2 | v52.4,52.2 51.2,53.4 47.1,53.4 46.5,52.8 46.5,21.6 42.9,18 32.7,18 29.3,21.4 29.3,58.3 31.5,60.5 v32.8,60.5
  Top 0.305: v32.8,60.5 35.8,60.5 arc90 J3_1.22
  Bottom 0.254: v52.4,52.2 v58.1,52.2
  Bottom 0.305: J3_2.22 35.49,60.5 v32.8,60.5
CLKS2  (via drill 0.5)
  Top 0.254: v32.8,53 35.75,53 J3_1.34
  Bottom 0.254: v32.8,53 35.5,53 J3_2.34
CLKX0  (via drill 0.5)
  Top 0.254: J3_1.21 40,60.5 v43,60.5 46.2,57.3 53.4,57.3 54.8,55.9 v54.8,47.8 | v69.5,46.7 U1.40
  Bottom 0.254: v43,60.5 40.25,60.5 J3_2.21 | v54.8,47.8 56.3,46.4 69.2,46.4 v69.5,46.7
CLKX2  (via drill 0.5)
  Top 0.254: J3_1.33 v43,52.94
  Bottom 0.254: v43,52.94 J3_2.33
CNTL0  (via drill 0.5)
  Top 0.254: v32.8,34 35.75,34 J3_1.64
  Bottom 0.254: v32.8,34 35.5,34 J3_2.64
CNTL1  (via drill 0.5)
  Top 0.254: v43,33.89 J3_1.63
  Bottom 0.254: J3_2.63 v43,33.89
DC_DET#  (via drill 0.5)
  Top 0.254: v43,26.25 40,26.25 J3_1.75
  Bottom 0.254: v43,26.25 40.25,26.25 J3_2.75
DR0  (via drill 0.5)
  Top 0.254: 35.75,55.5 J3_1.30 | U1.13 59.8,56.5 58.5,55.2 v58.1,55.2 | v52.4,54.6 46.5,54.6 45.3,53.4 45.3,22 42.5,19.2 33.3,19.2 30.5,22 30.5,54.5 31.5,55.5 v32.75,55.5
  Top 0.61: v32.75,55.5 35.75,55.5
  Bottom 0.254: v32.75,55.5 33,55.5 35.5,55.5 J3_2.30 | v58.1,55.2 57.5,54.6 v52.4,54.6
  Bottom 0.61: J3_2.30 35.53,55.5 33,55.5
DR2  (via drill 0.5)
  Top 0.254: v32.8,47.86 J3_1.42
  Bottom 0.254: v32.8,47.86 J3_2.42
DX0  (via drill 0.5)
  Top 0.254: 35.75,59.29 J3_1.24 | U1.15 59.6,55.5 58.9,54.8 58.9,54.4 58.5,54 v58.1,54 | v52.4,53.4 51.8,54 46.8,54 45.9,53.1 45.9,21.8 42.7,18.6 33,18.6 29.9,21.7 29.9,57.7 31.5,59.3 32.74,59.3 v32.8,59.29
  Top 0.305: v32.8,59.29 35.75,59.29
  Bottom 0.254: 35.5,59.29 J3_2.24 | v58.1,54 57.5,53.4 v52.4,53.4
  Bottom 0.305: v32.8,59.29 35.5,59.29
DX2  (via drill 0.5)
  Top 0.254: v32.8,51.67 J3_1.36
  Bottom 0.254: v32.8,51.67 J3_2.36
ECL_KOUT  (via drill 0.5)
  Top 0.254: 35.75,25 J3_1.78
  Top 0.305: v32.8,25 35.75,25
  Bottom 0.254: 35.5,25 J3_2.78
  Bottom 0.305: v32.8,25 35.5,25
ESLEBT  (via drill 0.5)
  Top 0.254: R17.2 53.7,37.8 55.8,39.9 56.7,39.9 57.7,40.9 57.7,42.7 55.8,44.6 55.8,48.3 55.3,48.8 55.3,56.1 53.9,57.5 53.9,60.4 57.5,64 v58.5,64 | v65.7,63 65.5,63.2 U1.94
  Bottom 0.254: v58.5,64 59.1,63 59.6,62.5 62,62.5 63.3,63.8 64.9,63.8 v65.7,63
EXT_INT4  (via drill 0.5)
  Top 0.254: v43,40.24 J3_1.53
  Bottom 0.254: J3_2.53 v43,40.24
EXT_INT5  (via drill 0.5)
  Top 0.254: v32.8,44.05 J3_1.48
  Bottom 0.254: v32.8,44.05 J3_2.48
EXT_INT6  (via drill 0.5)
  Top 0.254: v43,31.4 40.1,31.4 J3_1.67
  Bottom 0.254: v43,31.4 40.25,31.4 J3_2.67
EXT_INT7  (via drill 0.5)
  Top 0.254: v32.8,31.5 35.75,31.5 J3_1.68
  Bottom 0.254: v32.8,31.5 35.5,31.5 J3_2.68
FRAMEOK1
  Top 0.254: R18.2 57.7,40.2 58.2,40.7 58.2,42.9 56.3,44.8 56.3,48.5 55.8,49 55.8,56.3 54.4,57.7 54.4,60.2 55.7,61.5 U1.3
FRAMEOK2
  Top 0.254: R20.2 61.7,40.1 56.8,45 56.8,48.7 56.3,49.2 56.3,56.5 54.9,57.9 54.9,60 55.9,61 U1.4
FRAMEOK3
  Top 0.254: R22.2 65.7,39.6 65.48,39.82 62.68,39.82 57.3,45.2 57.3,48.9 56.8,49.4 56.8,56.7 55.4,58.1 55.4,59.8 56.1,60.5 U1.5
FSR0  (via drill 0.5)
  Top 0.254: v52.3,47 52.3,48.2 53.3,49.2 53.3,55.3 53.1,55.5 v43,55.5 | U1.44 71.5,47.8 73.4,45.9 v73.4,45.5
  Top 0.305: v43,55.5 39.89,55.5 arc90 J3_1.29
  Bottom 0.254: v52.3,47 52.3,46.5 54.2,44.6 72.5,44.6 v73.4,45.5
  Bottom 0.305: J3_2.29 40.19,55.5 v43,55.5
FSR2  (via drill 0.5)
  Top 0.254: v43,47.75 40,47.75 J3_1.41
  Bottom 0.254: v43,47.75 40.25,47.75 J3_2.41
FSX0  (via drill 0.5)
  Top 0.254: v54,47 54,48.5 54.3,48.8 54.3,55.7 53.3,56.7 45.9,56.7 43.31,59.29 v43,59.29 | v70.8,46.3 70.8,46.7 70,47.5 U1.41
  Top 0.305: J3_1.23 v43,59.29
  Bottom 0.254: 40.25,59.29 J3_2.23 | v54,47 54,46.8 55,45.8 70.3,45.8 v70.8,46.3
  Bottom 0.305: v43,59.29 40.25,59.29
FSX2  (via drill 0.5)
  Top 0.254: J3_1.35 v43,51.67
  Bottom 0.254: v43,51.67 J3_2.35
GND  (via drill 0.5, 0.5 pad 0.3, 0.6)
  Top 0.254: Q2.2 68.35,73.35 C18.1 68.1,74.7 | Q1.2 63.25,67.65 62.15,67.65 | U1.91 67,63.3 67.2,63.1 68.4,63.1 69,62.5 U1.87 | v72.5,62.85 U1.80 | v66.5,51.5 U1.23 | U1.14 62.67,56 v62.7,55.97 | U1.18 61.6,54 61.8,54.2 62.7,54.2 63.1,53.8 v66.2,53.8 | U1.95 65,63.4 64.9,63.3 64.9,62.2 v66.7,60.4 | 62.15,67.65 C19.1 | 62.15,67.65 62,67.5 61.5,67.5 | T3.2 56.42,34.42 56.05,34.42 T11.2 | T4.2 60.05,33.85 60,33.7 60,26.95 T12.2 | T13.2 64.05,33.7 T5.2 | 94.4,86.2 94.4,86 98,82.4 98,72.39 SW2.3 SW2.4 | 94.4,86.5 94.4,86.2 | 94.4,86.8 94.4,86.5 | 94.4,86.8 94.4,88.95 SV3.3 | 94.7,86.5 101.5,86.5 101.5,88.5 | 94.4,86.5 94.7,86.5 | 94.7,86.5 94.4,86.2 | 94.4,86.8 94.7,86.5 | JP1.8 102,31.45 C36.2 | TP_FPGA_GND.TP 51.12,50.8 51.5,50.4 v52.5,50.4 | v43,41.51 J3_1.51 | 37.8,41.5 37.9,41.6 37.9,46.6 | TP_ADAT_GND.TP 103.9,20.2 v103.1,19.4 | 24.4,53.88 24.91,53.98 24.7,53.9 24.92,54.09 IC4.1 | SW1.1 SW1.2 SW1.3 108.63,93.77 | T19.2 116.4,81.7 115.3,82.8 115.3,84.3 v115.9,84.9 | 101.5,88.5 101.5,90.5 | 101.5,90.5 101.5,94.1 102,94.6 107.8,94.6 108.63,93.77 | T16.2 108.5,89.95 108.5,93.77 108.63,93.77 | T17.2 102.45,90.5 101.5,90.5 | 101.5,88.5 v101.4,88.5 | 69.8,80.7 | 69.8,80.7 C38.2 | v99,24 99,23.8 C35.- | v46.7,78 v46.7,79.2
  Top 0.305: U1.58 75.3,54 v74.9,54.5 74.9,56.3 75.1,56.5 U1.63 | U1.47 73,50.4 72.3,51.1 71,51.1 70.5,50.6 U1.42 | U1.8 63.5,59 v64,58.5 | U1.74 75.1,62 74.6,61.5 v74.6,60.1 74.6,60 75.1,59.5 U1.69 | 68.1,74.7 67.3,73.9 67.3,69.8 67,69.5 65.3,69.5 65,69.2 65,67.4 64.7,67.1 62.65,67.1 C19.1 | 87,66.38 87.02,66.36 C15.2 | v43,25 | J3_1.62 arc90 35.83,35.16 | J3_1.52 v32.8,41.51 | J3_1.76 arc90 35.84,26.27 | v32.8,46.59 J3_1.44 36.4,46.59 arc-90 36.31,46.59 | v43,46.6 40.1,46.6 arc90 40,46.5 37.87,46.5 | 37.87,50.4 J3_1.37 | 42.99,54.21 v43,54.2 | 32.71,54.21 v32.8,54.2 | J3_1.26 arc-90 35.84,58.02 | 37.87,58 37.86,58.02 | 35.82,69.45 arc-90 J3_1.8 35.87,69.4 37.87,69.4 | J3_1.79 | 56.42,34.42 57.15,33.7 60,33.7 64.05,33.7 v68.05,33.7 T6.2 | T7.2 70,34.1 70,33.1 | 70,33.1 70,32.8 v69.8,32.6 | 74.05,32.85 T9.2 | v73.8,32.6 74.05,32.85 | T8.2 72.05,32.65 71.7,33 70.1,33 70,33.1 | T10.2 76.05,32.65 75.7,33 74.2,33 74.05,32.85 | v51.45,32.35 T2.2 | 40,71.99 J3_1.3 | v56.7,84 56.95,83.75 T1.2 | 91.6,62.3 91.62,62.3 91.92,62.08 91.92,62.12
  Top 0.406: 61.5,67.5 61,67.5 v60.7,67.3 | 91.92,62.08 91.92,61.5 | 91.92,62.08 91.92,61.83 91.53,62.23 | 91.92,62.08 IC2.11 | 37.87,26.27 37.7,26.27 | v69.5,62 69,62.5 | 37.87,25 38,25 | v81.4,66.4 81.35,66.4 arc-90 81.4,66.35 | 23.9,68.6 24.38,69.08 24.5,69.08 | 23.9,68.6 23,68.6 21.88,69.72 IC3.19 17.73,69.72 16.6,68.6 16.6,66.55 C39.1 | 22.31,53.98 21.57,54.73 IC4.19 17.73,54.73 17.32,54.33 | IC5.1 23,36.08 22.52,36.08 21.88,36.73 IC5.19 19.06,36.7 17.7,36.7 16.15,35.15 C43.1 | 24.4,42.04 24.3,42.2 24.3,41.9 24.89,41.9 IC5.10 | 24.89,60.2 IC4.10 24.99,60 | 24.5,69.08 IC3.1 26.93,69.08 26.95,69.1 | 23.9,68.6 23.85,68.6 | 24.27,68.85 26.55,68.85 | 25.15,68.7 25.7,68.15 25.85,68.15 26,68 | 23.9,68.6 26.15,68.6 | 24.27,68.85 24.25,68.85 | 24.5,69.08 24.27,68.85 | 26.62,74.92 IC3.10 | 91.92,62.12 91.53,62.52
  Top 0.55: 37.87,23.73 37.87,25 37.87,26.27 37.87,35.16 37.87,41.51 37.87,46.5 | 37.87,46.59 37.87,50.4 37.87,54.21 37.87,58 37.87,69.4 37.87,69.45 37.87,71.99 | 24.4,53.88 24.5,54 24.91,53.98 22.31,53.98 | 27.3,69.45 27.25,69.1 27.25,74.3 26.62,74.92 | 17.32,54.33 16.73,54.33 16.2,53.8 16.2,53.05 C41.1 | IC5.1 23.06,36.03
  Top 0.61: v70.1,52 71,51.1 | C16.1 87.02,66.36 | v70.91,76.91 v68.3,79.5 69.5,80.7 69.8,80.7 70.9,80.7 73,80.7 SV2.1 | v32.8,35.16 35.83,35.16 J3_1.62 37.87,35.16 J3_1.61 | J3_1.52 37.87,41.51 39.59,41.51 39.6,41.5 37.8,41.5 | J3_1.79 37.87,23.73 J3_1.80 | J3_1.80 v32.8,23.73 J3_1.80 | 37.7,26.27 J3_1.76 | 35.84,26.27 v32.8,26.27 | J3_1.61 J3_2.61 | J3_2.61 v43,35.16 | 36.4,46.59 37.87,46.59 37.91,46.59 | 37.87,50.4 J3_1.38 | J3_1.38 v32.8,50.4 J3_1.38 | 37.87,50.4 v43,50.4 | J3_1.31 37.87,54.21 J3_1.32 | J3_1.31 42.99,54.21 | J3_1.32 32.71,54.21 | v43,58.02 J3_1.25 37.87,58 | 37.86,58.02 J3_1.26 v32.8,58.02 | J3_1.79 v43,23.73 | C15.2 87.96,66.34 88.2,66.1 88.2,65.7 91.6,62.3 | C16.1 C17.1 | 81.4,66.35 C16.1 | 38,25 J3_1.77 | J3_1.77 v43,25 | C37.2 96.05,17.95 v96,18 | 37.91,46.59 J3_1.43 | 37.91,46.59 37.9,46.6 | 23.06,36.03 27.7,36.03 27.7,43.7 24.6,43.7 24.4,43.6 | 24.4,43.6 24.4,46.4 | 24.4,43.6 24.4,42.04 | J3_1.61 J3_2.61 | J3_1.4 J3_2.4 | J3_1.7 v43,69.45 | J3_1.32 35.85,54.2 v32.8,54.2 | J3_1.31 39.88,54.2 v43,54.2 | J3_1.44 v32.8,46.59 | J3_1.77 v43,25 | 24.7,53.9 24.8,53.9 24.6,53.7 24.5,53.7 24.4,53.6 | 24.4,51.9 27.4,51.9 28.1,52.6 28.1,58.7 26.8,60 24.99,60
  Top 0.813: v32.8,71.99 J3_2.4 J3_1.4 37.87,71.99 J3_1.3 | C2.2 46.98,77.38 46.96,77.36 | 40,71.99 v43,71.99 | C35.- 100.3,22.7 v99,24 97.05,25.95 C36.2 | 24.4,49.5 C42.- | v24.4,46.6 v24.4,47.6 | v24.4,47.6 24.4,49.5 | 24.4,49.5 24.4,51.9 24.4,53.6 24.4,53.88 | C41.1 16.15,44.05 15.54,43.46 U$2.SHIELD | v24.4,46.6 24.4,49.5 | v24.4,46.6 v24.4,47.6 | 24.4,46.4 v24.4,46.6 | TP_EINGANG_GND.TP 46.7,74.8 v47.2,75.3
  Top 1.016: J3_1.8 37.87,69.45 J3_1.7 v43,69.45 43.45,69.45 44.2,68.7 44.2,68.5 44.9,67.8 47.1,67.8 C29.- 47.1,68 | 35.82,69.45 v32.8,69.45 29.45,69.45 28.95,69.45 27.3,69.45 26.95,69.1 26,68.15 26,68 26,64.7 C40.- 26.1,64.1 25,63 25,60.31 24.89,60.2 | C27.- 50.15,37.15 C28.1 v51.45,37.1 | C27.- 54.1,42 53.5,41.4 53.5,40.7 55.05,42.05 C27.- | v24.4,46.6 v24.4,47.6 | C39.1 13.12,66.5 U$1.SHIELD | U$3.SHIELD 14.22,20.5 15.61,21.89 15.61,33.09 C43.1 | C44.- 23,32.1 23,36.08 | SV4.13 74.34,88.81 v74.34,85.67
  Top 1.422: C29.- v47.2,73.9 | v47.2,75.3 47.2,77.12 46.96,77.36 46.7,77.62 v46.7,78 v46.7,79.2 46.7,80.78 | 46.7,80.78 IC1.1 | v51.7,66.7 51.7,69.6 51.8,69.7 C30.- | 46.7,80.78 46.78,80.78 47,81
  Top 1.93: v47.2,73.9 v47.2,75.3
  Bottom 0.254: J3_2.38 35.75,50.4 40,50.4 J3_2.37 | J3_2.44 35.75,46.59 40,46.5 J3_2.43 | 40,35.15 J3_2.61 | 35.75,41.51 J3_2.52 | 40,41.5 J3_2.51 | v56.7,84 48,84 47.45,83.45 C1.2 | 65.5,53.3 v66.2,53.8 | v66.7,60.4 66.7,58.8 67,58.5 | 53.75,66.75 54.75,65.89 | v52.5,50.4 58,50.4 59.1,51.5 65.3,51.5 C6.1 | 39.8,41.51 v43,41.51 | v103.1,19.4 104.4,18 L2.1 | v115.9,84.9 113.45,82.45 T18.2 112.15,82.45 111.1,81.4 111.1,80.7 110.7,80.3 108.7,80.3 107.6,81.4 T14.2 106.5,84.15 106.5,84.7 106.1,85.1 T15.2 103.45,87.55 102.5,88.5 v101.4,88.5 | U$3.SHIELD 13.08,8.08 TP_GND.P$1 | 101.05,18.05 TP_4.P$1 | 46.7,80.8 46.5,81 46.5,79
  Bottom 0.305: v74.9,54.5 73.8,54.5 73.85,54 C10.2 | v72.5,62.85 72.5,62.8 71.4,63.9 70.6,63.9 69.7,63 69.7,62.3 v69.5,62 | 65.35,51.5 v66.5,51.5 | v64,58.5 63.1,59.4 63.05,60.4 C14.2 | C12.2 73.35,60.1 | J3_2.77 | 40.15,35.16 40,35.15 J3_1.62 J3_2.62 | v32.8,41.51 35.75,41.51 | v32.8,46.59 35.75,46.59 | J3_2.43 v43,46.59 arc90 v43,46.6 | 40.1,50.4 40,50.4 | 35.54,54.2 J3_2.32 | 35.53,58.02 J3_2.26 | J3_2.4 arc-90 35.46,71.99 | J3_2.79 | 65.3,60.2 65.26,60.16 C13.2 | 71,58.5 71.5,58 C9.2 | v69.8,32.6 70,32.8 70,33.7 | v73.8,32.6 74,32.8 74,33.7 | 51.45,33.7 v51.45,32.35
  Bottom 0.406: v62.7,55.97 62.73,56 65,56 65.35,55.85 | v60.7,67.3 58.3,64.9 58,64.8 56.95,63.75 56.95,63.55 | C26.2 75.3,56.15 73.5,54.35 | 69,58.5 C33.2 | 71.65,56 C34.2 | C31.2 67.05,58.45 67,58.5 | v43,71.99 v42.99,71.99 | v70.91,76.91 81.42,66.4 v81.4,66.4
  Bottom 0.61: 40,41.5 39.8,41.51 35.75,41.51 | 70.1,53.35 v70.1,52 | v68.3,79.5 v74.34,85.67 | v74.34,85.67 74.83,86.17 | 74.83,86.17 77.8,89.2 78.9,90.27 SV3.13 SV3.11 | SV3.11 SV3.9 | SV3.9 SV3.7 | SV3.7 SV3.5 | SV3.5 SV3.3 | SV3.3 SV3.1 | v43,25 J3_2.77 | v32.8,35.16 J3_2.62 | v43,35.16 40.15,35.16 | v32.8,23.73 J3_2.80 | v32.8,26.27 J3_2.76 | v32.8,50.4 J3_2.38 | v43,50.4 40.1,50.4 | v32.8,54.2 35.54,54.2 | v32.8,58.02 35.53,58.02 | v43,58.02 J3_2.25 | v43,23.73 J3_2.79 | 96.6,22.5 93.55,19.45 | 93.55,19.45 90.1,16 88,16 86.73,17.27 SV1.19 | v96,18 95,18 93.55,19.45 | 35.46,71.99 J3_2.4 | J3_2.31 v43,54.2 | J3_2.77 v43,25 | SV3.11 SV3.9 | SV3.9 SV3.7 | SV3.7 SV3.5 | SV3.5 SV3.3 | v74.34,85.67 74.83,86.16 74.83,86.17 | v43,69.45 J3_2.7 v43,69.45
  Bottom 0.813: 69.5,58.5 v69.5,62 | C8.1 65.35,59.35 65.3,60.2 | v32.8,71.99 35.46,71.99 | L2.1 103.4,18 101.1,18 101.05,18.05 96.6,22.5 96.6,24 | 96.6,24 96.6,49.1 52,49.1 51,50.1 | v42.99,71.99 J3_2.3 | C32.2 68.2,58.7 68,58.5 | v51.45,37.1 51.45,37.25 | 96.6,24 v99,24
  Bottom 1.016: v43,69.45 J3_2.7 | C5.1 65.35,51.5 C6.1 | C10.2 73.5,54.35 72.5,54.35 | 72.5,54.35 C3.1 70.1,53.35 C4.1 67.15,53.35 | 72.5,54.35 71.65,53.7 71.65,56 C9.2 71.1,58.75 C11.2 73,59.95 73.2,60.15 C12.2 | 73.35,60.1 v74.6,60.1 | C8.1 65.35,55.85 C7.1 C6.1 | 67.15,53.35 65.5,53.3 | C6.1 66.2,53.35 67.15,53.35 | 54.75,65.89 v68.3,79.5 | v32.8,69.45 J3_2.8 | 74,33.7 70,33.7 51.45,33.7 51.45,37.25 | v51.45,37.1 51.5,37.1 51,37.6 51,50.1 51,64 53.75,66.75 | R2.2 C1.2 | SV4.1 SV4.3 SV4.5 SV4.7 SV4.9 SV4.11 SV4.13
  Bottom 1.422: 52.1,68.4 53.75,66.75 56.95,63.55 62,58.5 v64,58.5 67,58.5 68,58.5 69,58.5 69.5,58.5 71,58.5 | 52.1,68.4 47.2,73.3 v47.2,75.3 | R2.2 46.7,80.8 v46.7,78 | v51.7,66.7 51.7,68 52.1,68.4
  other vias: 51.7,67.8
  pour Top: 1,1 1,76 28.5,76 48,76 48,66 45,63 45,1
  pour Bottom (isolate 0.254): 1,1 0.5,76 48,76 48,66 45,63 45,1
  pour Bottom: 80.2,96.5 65.2,82.2 58.8,76 53,76 50.6,71.6 50.6,64.1 47,60.5 47,1 105,1 105,18 106,19 121,19 121,96.8
IO_2/MOSI/CSI_B
  Top 0.254: SV1.1 86.73,42.27 83.5,45.5 74.8,45.5 72.5,47.8 U1.46
IO_L01N_0
  Top 0.254: U1.78 73.5,65.4 80.1,72 82.2,72 84.4,74.2 86.7,74.2 88.5,76 89.7,76 90.4,76.7 90.4,78.66 SV2.14
IO_L01P_0/VREF_0
  Top 0.254: U1.77 74,65.2 80.3,71.5 82.4,71.5 84.6,73.7 86.9,73.7 88.7,75.5 90,75.5 91.61,77.11 SV2.13
IO_L02N_0/GCLK5
  Top 0.254: U1.84 70.5,65.6 71.4,66.5 72.5,66.5 79.5,73.5 81.6,73.5 83.8,75.7 85.2,75.7 86.53,77.03 SV2.9
IO_L02N_1/RHCLK1
  Top 0.254: U1.60 80.5,55 83.1,52.4 83.1,49.5 89.5,43.1 90.5,43.1 91.9,41.7 91.9,39.3 91.4,38.8 91.4,36 90.9,35.5 90.9,33.7 90.4,33.2 90.4,31.4 SV1.10
IO_L02P_0/GCLK4
  Top 0.254: U1.83 71,65.4 71.6,66 72.7,66 79.7,73 81.8,73 84,75.2 86.3,75.2 87.8,76.7 87.8,78.6 SV2.12
IO_L02P_1/RHCLK0
  Top 0.254: U1.59 80.3,54.5 82.6,52.2 82.6,49.3 89.3,42.6 90.3,42.6 91.4,41.5 91.4,39.5 90.9,39 90.9,36.2 90.4,35.7 90.4,33.94 SV1.8
IO_L03N_0/GCLK7
  Top 0.254: U1.86 69.5,66 71,67.5 72.1,67.5 79.1,74.5 81.2,74.5 83.99,77.29 SV2.7
IO_L03N_1/TRDY1/RHCLK3
  Top 0.254: U1.62 80.9,56 84.1,52.8 84.1,49.9 89.9,44.1 90.9,44.1 92.9,42.1 92.9,38.9 92.4,38.4 92.4,35.6 91.9,35.1 91.9,33.3 91.4,32.8 91.4,31 90.9,30.5 90.9,28.7 90.4,28.2 90.4,26.32 SV1.14 87.98,23.9 85.8,23.9 83.5,21.6 83.5,13.8 82.2,12.5 60.5,12.5 59.4,11.4 59.4,5.4 57,3 TP_IO_L03N_1/TRDY1/RHCLK3.P$1
IO_L03N_2/VS2  (via drill 0.5)
  Top 0.254: U1.29 64,43 v64.5,42.5 | IC3.17 IC3.4 26.6,71.03 | IC3.15 IC3.6 26.6,72.33 | 20,73.62 IC3.13 | 20,73.62 IC3.8 26.6,73.62 26.6,72.33 | IC3.11 20,74.92 20,73.62 | 26.6,71.03 26.6,72.33 | 26.6,71.03 26.6,70.03 26.3,69.72 IC3.2 23.62,69.72 v23.4,69.5 | 20,58.62 IC4.8 26.6,58.62 26.6,57.5 | 20,58.62 IC4.13 | IC4.15 IC4.6 26.6,57.33 26.6,57.5 | IC4.17 IC4.4 26.6,56.02 26.6,56 | 26.6,54.73 26.6,56 | 26.6,56 26.6,57.5 | IC4.11 20,59.92 20,58.62 | 20,40.62 IC5.8 26.6,40.62 | 20,40.62 IC5.13 | IC5.15 IC5.6 26.57,39.33 26.6,39.3 | IC5.17 IC5.4 26,38.02 26.6,38 | IC5.2 26.6,36.73 26.6,38 | 26.6,40.62 26.6,39.3 | 26.6,39.3 26.6,38 | IC5.11 20,41.92 20,40.62 | 26.6,54.73 IC4.2 | v26.6,53 26.6,54.73 | v26.6,42.7 26.6,40.62 | v52.46,43.97 52.08,43.59 52.08,40.92 v49.67,38.51
  Bottom 0.254: 86.73,20.13 SV1.17 85.6,21.24 85.6,23 85.1,23.5 85.1,25.4 70.16,40.24 69.98,40.42 66.58,40.42 v64.5,42.5 64.19,42.19 56.78,42.19 55,43.97 v52.46,43.97 | v23.4,69.5 23.4,64.6 21.1,62.3 21.1,61.6 26,56.7 v26.6,53 v26.6,42.7 28.59,40.71 28.59,21.11 32.27,17.43 43.32,17.43 46.95,21.05 | v49.67,38.51 47.13,35.97 47.13,21.24 46.95,21.05 | TP_GND4.P$1 44,14 47,17 47,21 46.95,21.05
IO_L03N_3/LHCLK1  (via drill 0.5)
  Top 0.254: U1.10 59.8,58 59.4,57.6 v58.9,57.6 | v52.2,61.1 53.2,61.1 53.9,61.8 53.9,62.3 56.5,64.9 56.5,66.3 57.5,67.3 57.5,69.5 56.7,70.3 56.7,70.4 55.8,71.3 v55.8,71.8
  Bottom 0.254: v58.9,57.6 56.4,57.6 52.9,61.1 v52.2,61.1 | v55.8,71.8 56.5,72.5 57.6,72.5 78,92.9 97.3,92.9 98.6,91.6 98.6,81.9 98,81.3 98,78.64 SV2.17
IO_L03P_0/GCLK6
  Top 0.254: U1.85 70,65.8 71.2,67 72.3,67 79.3,74 81.4,74 83.6,76.2 84.8,76.2 85.3,76.7 85.3,78.64 SV2.10
IO_L03P_1/RHCLK2
  Top 0.254: U1.61 80.7,55.5 83.6,52.6 83.6,49.7 89.7,43.6 90.7,43.6 92.4,41.9 92.4,39.1 91.9,38.6 91.9,35.8 91.4,35.3 91.4,33.5 90.9,33 90.9,31.2 90.4,30.7 90.4,28.86 SV1.12
IO_L03P_3/LHCLK0  (via drill 0.5)
  Top 0.254: U1.9 58,58.5 v57.9,58.4 | v53,62.1 56,65.1 56,66.5 56.8,67.3 56.8,69.1 v55.8,70.1
  Bottom 0.254: v57.9,58.4 56.3,58.4 53,61.7 v53,62.1 | v55.8,70.1 55.8,70.6 57.2,72 57.8,72 78.2,92.4 97.1,92.4 98.1,91.4 98.1,82.1 96.69,80.69 SV2.18
IO_L04N_1/RHCLK7
  Top 0.254: U1.65 77.4,57.5 77.9,57 81.3,57 85.1,53.2 85.1,50.4 90.4,45.1 91.3,45.1 94,42.4 94,38.5 93.5,38 93.5,35.3 92.9,34.7 92.9,32.9 92.4,32.4 92.4,30.6 91.9,30.1 91.9,28.3 91.4,27.8 91.4,25.8 90.9,25.3 90.9,23.6 90.4,23.1 90.4,21.24 SV1.18 87.96,18.8 85.5,18.8 85,18.3 85,13.2 82.8,11 78,11 77.4,10.4 77.4,5.4 75,3 TP_IO_L04N_1/RHCLK7.P$1
IO_L04N_2/VS0  (via drill 0.5)
  Top 0.254: U1.31 65,44.4 v67.41,41.99 | SV1.13 86.3,25.2 83,21.9 83,14 82,13 55,13 53.4,11.4 53.4,5.4 51,3 TP_IO_L04N_2/VS0.P$1
  Bottom 0.254: SV1.13 70.6,41.32 70.6,41.33 70.5,41.43 67.97,41.43 v67.41,41.99
IO_L04P_0/GCLK8
  Top 0.254: U1.88 68.5,65.5 69,65.5 69,66.2 70.8,68 71.9,68 78.9,75 81,75 82.7,76.7 82.7,78.58 SV2.8
IO_L04P_1/IRDY/RHCLK6
  Top 0.254: U1.64 77.2,57 77.7,56.5 81.1,56.5 84.6,53 84.6,50.1 90.1,44.6 91.1,44.6 93.4,42.3 93.4,38.7 92.9,38.2 92.9,35.4 92.4,34.9 92.4,33.1 91.9,32.6 91.9,30.8 91.4,30.3 91.4,28.5 90.9,28 90.9,26.1 90.4,25.6 90.4,23.78 SV1.16 87.92,21.3 85.6,21.3 84.5,20.2 84.5,13.4 82.6,11.5 72,11.5 71.4,10.9 71.4,5.4 69,3 TP_IO_L04P_1/IRDY/RHCLK6.P$1
IO_L04P_2/VS1  (via drill 0.5)
  Top 0.254: U1.30 64.5,43.7 v65.88,42.27 | SW1.4 112.09,86.13 R42.2 110.99,81.19 110.6,80.8 110.6,78.8 107.4,75.6 107.4,69.8 97.8,60.2 97.77,60.2 97.67,60.1 97.67,50.07 94.63,47.02 94.63,45.11 v95.39,44.35 | SV1.15 86.15,22.65 84,20.5 84,13.6 82.4,12 66,12 65.4,11.4 65.4,5.4 63,3 TP_IO_L04P_2/VS1.P$1
  Bottom 0.254: SV1.15 85.6,23.68 85.6,25.6 70.49,40.74 70.3,40.92 67.28,40.92 v65.88,42.27 66.43,42.83 93.87,42.83 v95.39,44.35 | R30.1 112.16,86.2 SW1.4
IO_L04P_3/LHCLK2  (via drill 0.5)
  Top 0.254: U1.12 59.6,57 59.2,56.8 v58.1,56.8 | v53,59.8 53,60.2 54.4,61.6 54.4,62.1 57,64.7 57,66.1 58,67.1 58,70.25 v57.65,70.6
  Bottom 0.254: v58.1,56.8 56.5,56.8 53.5,59.8 v53,59.8 | SV2.16 94.47,79.87 97.1,82.5 97.1,91 96.7,91.4 78.6,91.4 57.8,70.6 v57.65,70.6
IO_L05P_0  (via drill 0.5)
  Top 0.254: U1.93 66,65.3 v66.5,65.8 | v68.6,67 69.1,67 70.6,68.5 71.7,68.5 78.7,75.5 80.8,75.5 81.45,76.15 SV2.5
  Bottom 0.254: v66.5,65.8 67.6,67 v68.6,67
IO_L06N_0/PUDC_B  (via drill 0.5)
  Top 0.254: U1.99 63,65.2 62.7,65.5 62.35,65.5 61.95,65.9 60.6,65.9 59.8,66.7 59.8,67.8 60.5,68.5 v60.8,68.5
  Bottom 0.254: v60.8,68.5 60.8,68.8 73.2,81.3 77.48,81.3 SV2.4
IO_L06N_2/D6
  Top 0.254: U1.35 67,45.7 69.5,43.2 74.5,43.2 74.8,43.5 82.6,43.5 84.1,42 84.1,38.3 84.6,37.8 84.6,36.1 85.1,35.6 85.1,33.7 85.6,33.2 85.6,31.4 SV1.9
IO_L06P_0/VREF_0  (via drill 0.5)
  Top 0.254: U1.98 63.5,65.5 v62.7,66.29
  Bottom 0.254: v62.7,66.29 62.7,70 71.3,78.6 77.64,78.6 SV2.3
IO_L06P_2/D7
  Top 0.254: U1.34 66.5,45.5 69.3,42.7 74.7,42.7 75,43 82.4,43 83.6,41.8 83.6,38.1 84.1,37.6 84.1,35.9 84.6,35.4 84.6,33.5 85.1,33 85.1,31.2 85.6,30.7 85.6,28.86 SV1.11
IO_L07N_2/D4